# EAGLE design expansioncard-template (EAGLE 7.5.0)

## Sheet 1 of 2: Board IO header
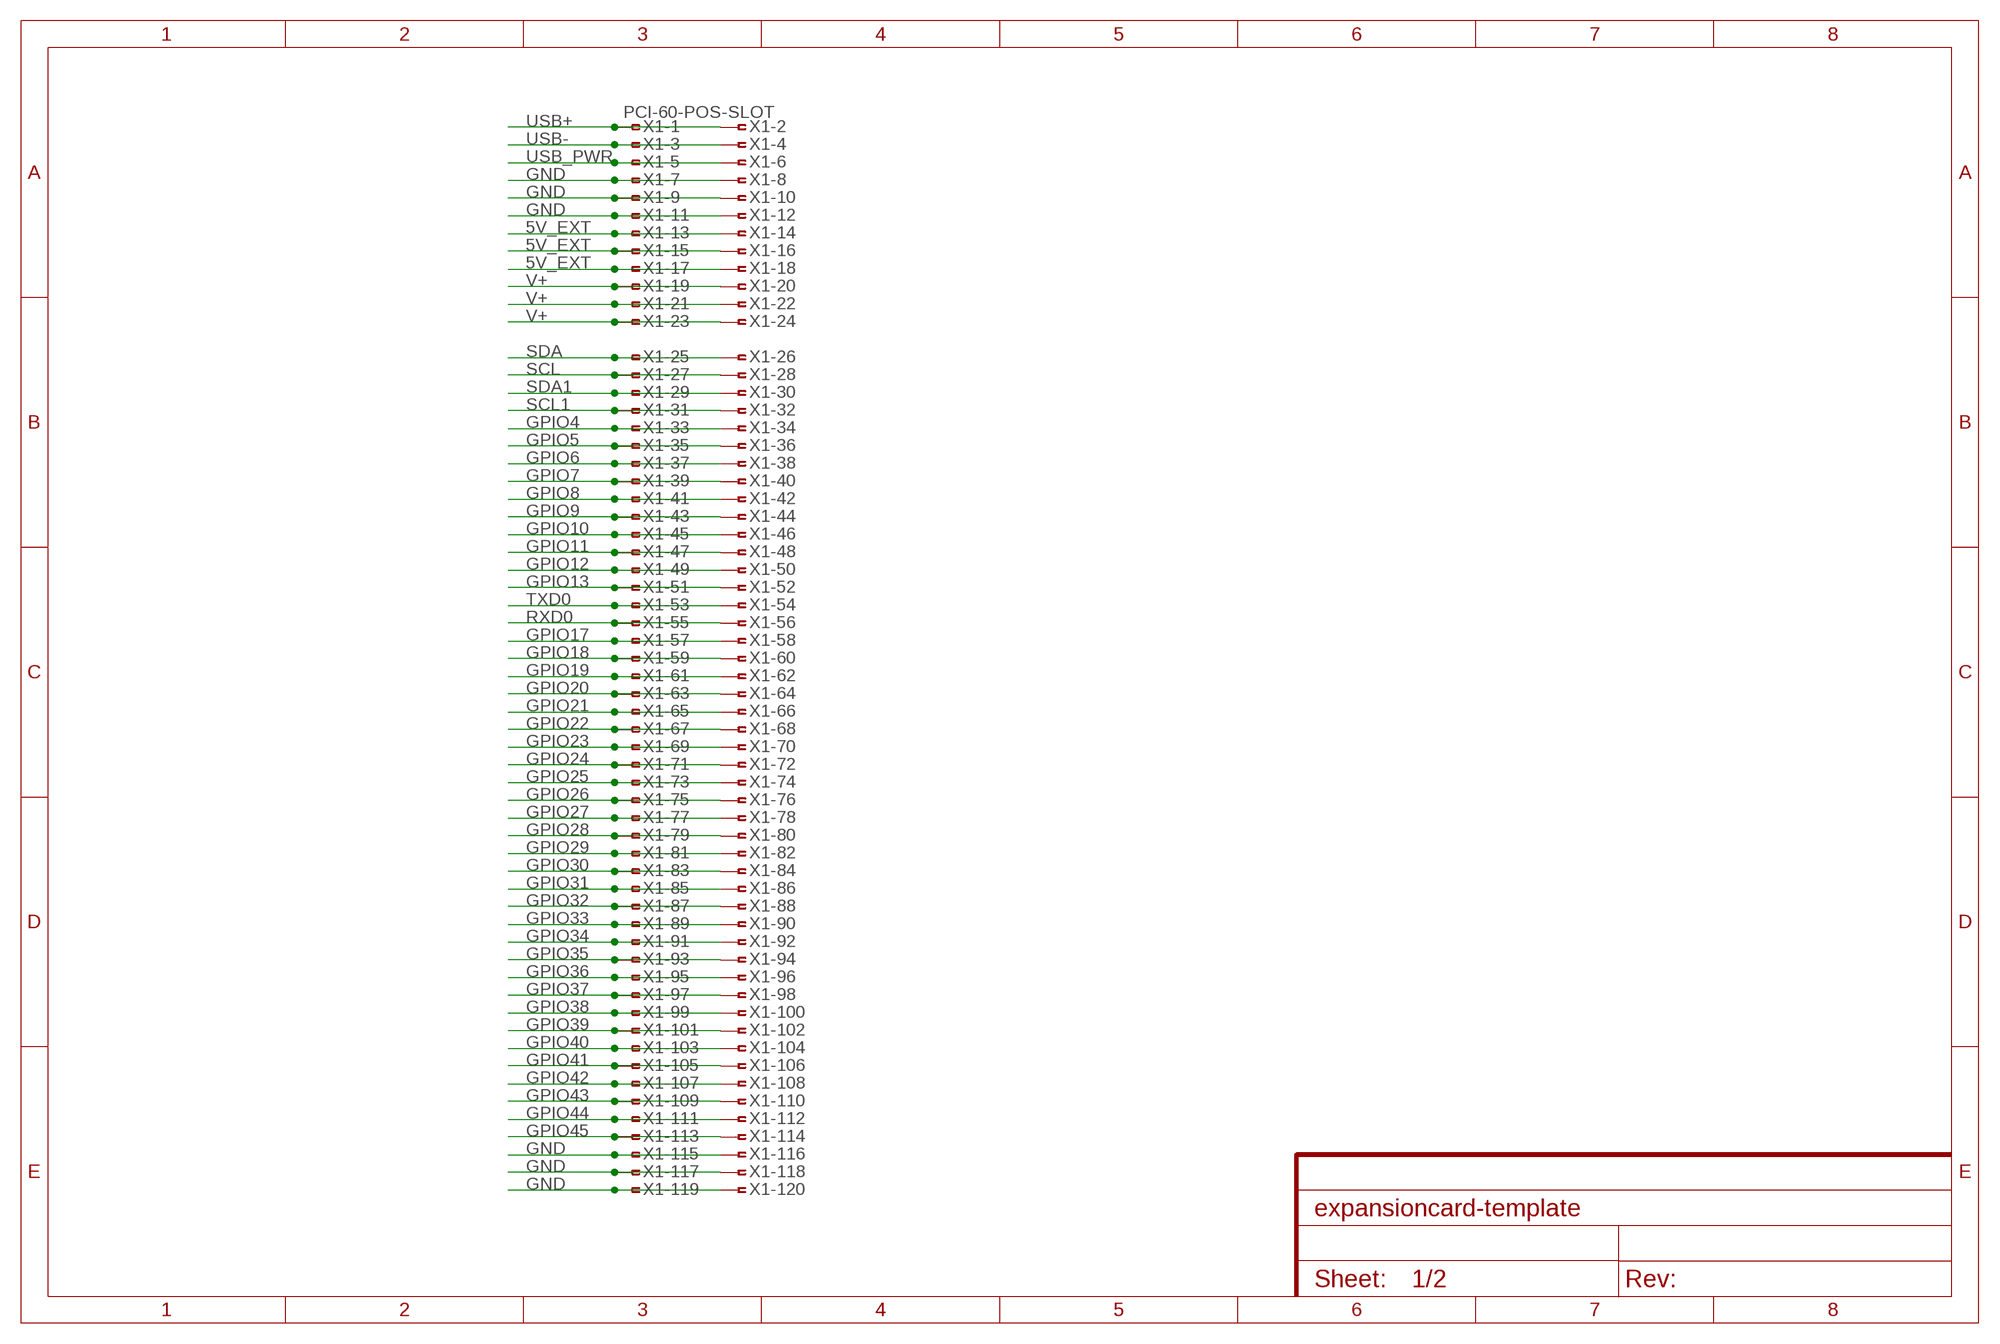
[diagram p0: schematic, sheet 1]

### Parts
X1  PCI-60-POS-SLOT  [PCI-SLOT-60]

### Nets
5V_EXT: X1.13 X1.14 X1.15 X1.16 X1.17 X1.18 ; also sheet 2
GND: X1.7 X1.8 X1.9 X1.10 X1.11 X1.12 X1.115 X1.116 X1.117 X1.118 X1.119 X1.120 ; also sheet 2
GPIO4: X1.33 X1.34
GPIO5: X1.35 X1.36
GPIO6: X1.37 X1.38
GPIO7: X1.39 X1.40
GPIO8: X1.41 X1.42
GPIO9: X1.43 X1.44
GPIO10: X1.45 X1.46
GPIO11: X1.47 X1.48
GPIO12: X1.49 X1.50
GPIO13: X1.51 X1.52
GPIO17: X1.57 X1.58
GPIO18: X1.59 X1.60
GPIO19: X1.61 X1.62
GPIO20: X1.63 X1.64
GPIO21: X1.65 X1.66
GPIO22: X1.67 X1.68
GPIO23: X1.69 X1.70
GPIO24: X1.71 X1.72
GPIO25: X1.73 X1.74
GPIO26: X1.75 X1.76
GPIO27: X1.77 X1.78
GPIO28: X1.79 X1.80
GPIO29: X1.81 X1.82
GPIO30: X1.83 X1.84
GPIO31: X1.85 X1.86
GPIO32: X1.87 X1.88
GPIO33: X1.89 X1.90
GPIO34: X1.91 X1.92
GPIO35: X1.93 X1.94
GPIO36: X1.95 X1.96
GPIO37: X1.97 X1.98
GPIO38: X1.99 X1.100
GPIO39: X1.101 X1.102
GPIO40: X1.103 X1.104
GPIO41: X1.105 X1.106
GPIO42: X1.107 X1.108
GPIO43: X1.109 X1.110
GPIO44: X1.111 X1.112
GPIO45: X1.113 X1.114
RXD0: X1.55 X1.56
SCL: X1.27 X1.28
SCL1: X1.31 X1.32
SDA: X1.25 X1.26
SDA1: X1.29 X1.30
TXD0: X1.53 X1.54
USB+: X1.1 X1.2
USB-: X1.3 X1.4
USB_PWR: X1.5 X1.6
V+: X1.19 X1.20 X1.21 X1.22 X1.23 X1.24 ; also sheet 2

## Sheet 2 of 2: Power Management
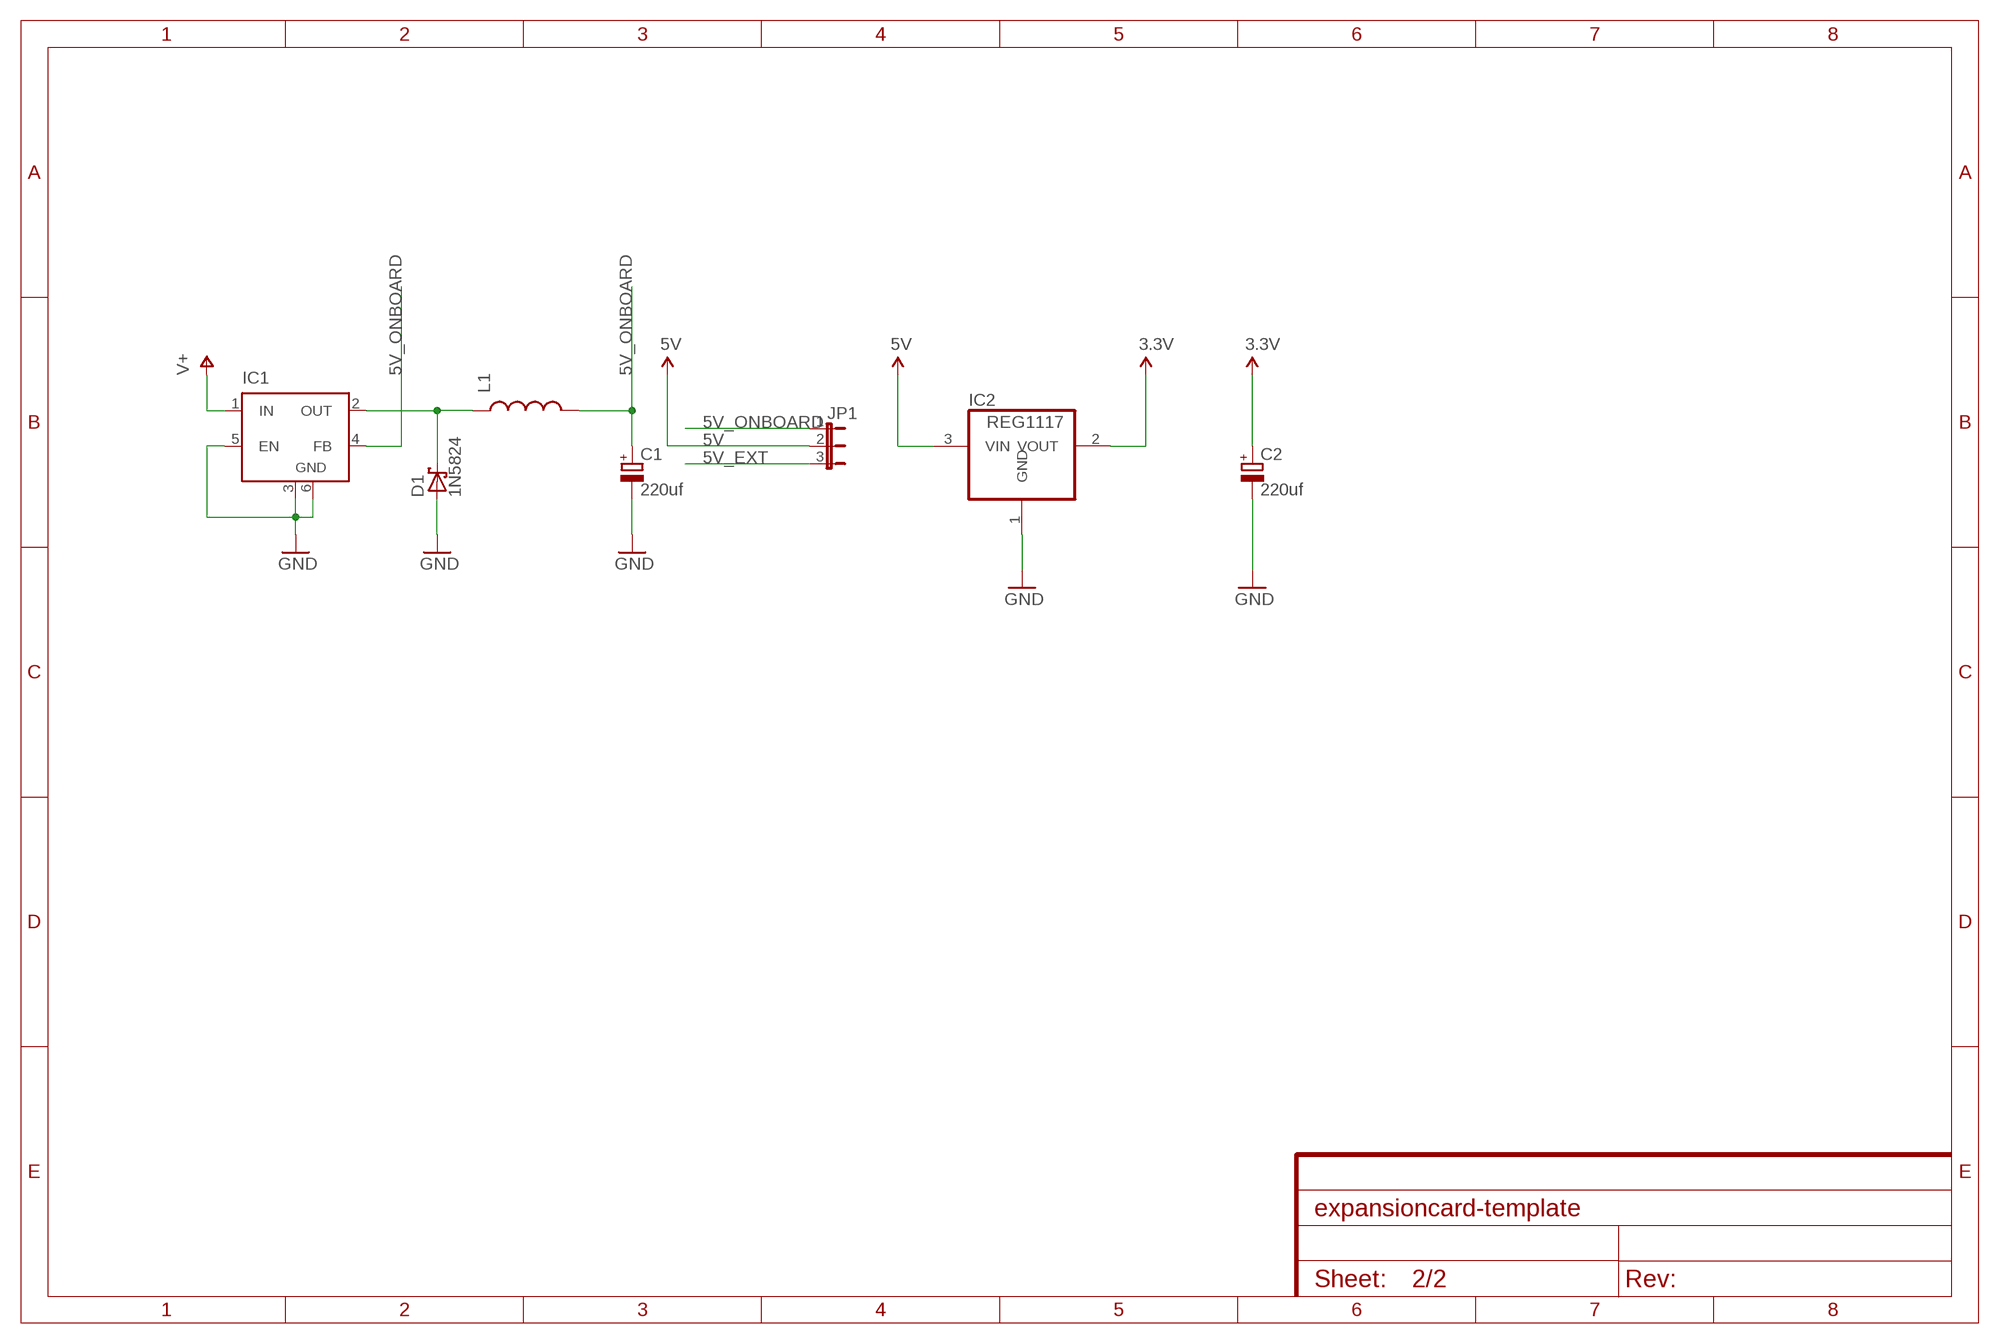
[diagram p1: schematic, sheet 2]

### Parts
C1  220uf  CPOL-EUE2.5-6  [E2,5-6]
C2  220uf  CPOL-EUE2.5-6  [E2,5-6]
D1  1N5824  1N5817-B  [DO41-7.6]
IC1  LM2596S  [TO263-5]
IC2  REG1117  [SOT223]
JP1  JP2E  [JP2]
L1  INDUCTORSRU1038  [SRU1038]

### Nets
3.3V: C2.+ IC2.2(VOUT)
5V: IC2.3(VIN) JP1.2
5V_EXT: JP1.3 ; also sheet 1
5V_ONBOARD: C1.+ IC1.4(FB) JP1.1 L1.2
GND: C1.- C2.- D1.A IC1.3(GND) IC1.5(EN) IC1.6(GND) IC2.1(GND) ; also sheet 1
V+: IC1.1(IN) ; also sheet 1
VOUT: D1.C IC1.2(OUT) L1.1

## Library data of the parts
C1 C2 = rcl:CPOL-EU: POLARIZED CAPACITOR, European symbol
D1 = diode:1N581*: 1.0A SCHOTTKY BARRIER RECTIFIER Source: http://www.diodes.com/datasheets/ds23001.pdf
IC1 = linear:LM2596S: STEP-DOWN VOLTAGE REGULATOR
IC2 = burr-brown:REG1117: 800mA and 1A Low Dropout (LDO) Positive Regulator 1.8V, 2.5V, 2.85V, 3.3V, 5V, and Adj; MPN: REG1117; OC_FARNELL: 1097566; OC_NEWARK: 14P6981
JP1 = jumper:JP2E: JUMPER
L1 = SparkFun-Passives:INDUCTOR: Inductors Basic Inductor/Choke - 0603 and 1206. Footprints are not proven and vary greatly between part numbers. SRN6045- 33uH, 20% 1.4A SDR0403-560KL - 56uH, 10%, 500mA RMS/740mA peak
X1 = con-amp:PCI-60-POS: PCI-SLOT 60 Dual Position 0.05 Series Standard Edge Source: http://catalog.tycoelectronics.com .. ENG_CD_145167_F.pdf

## Board
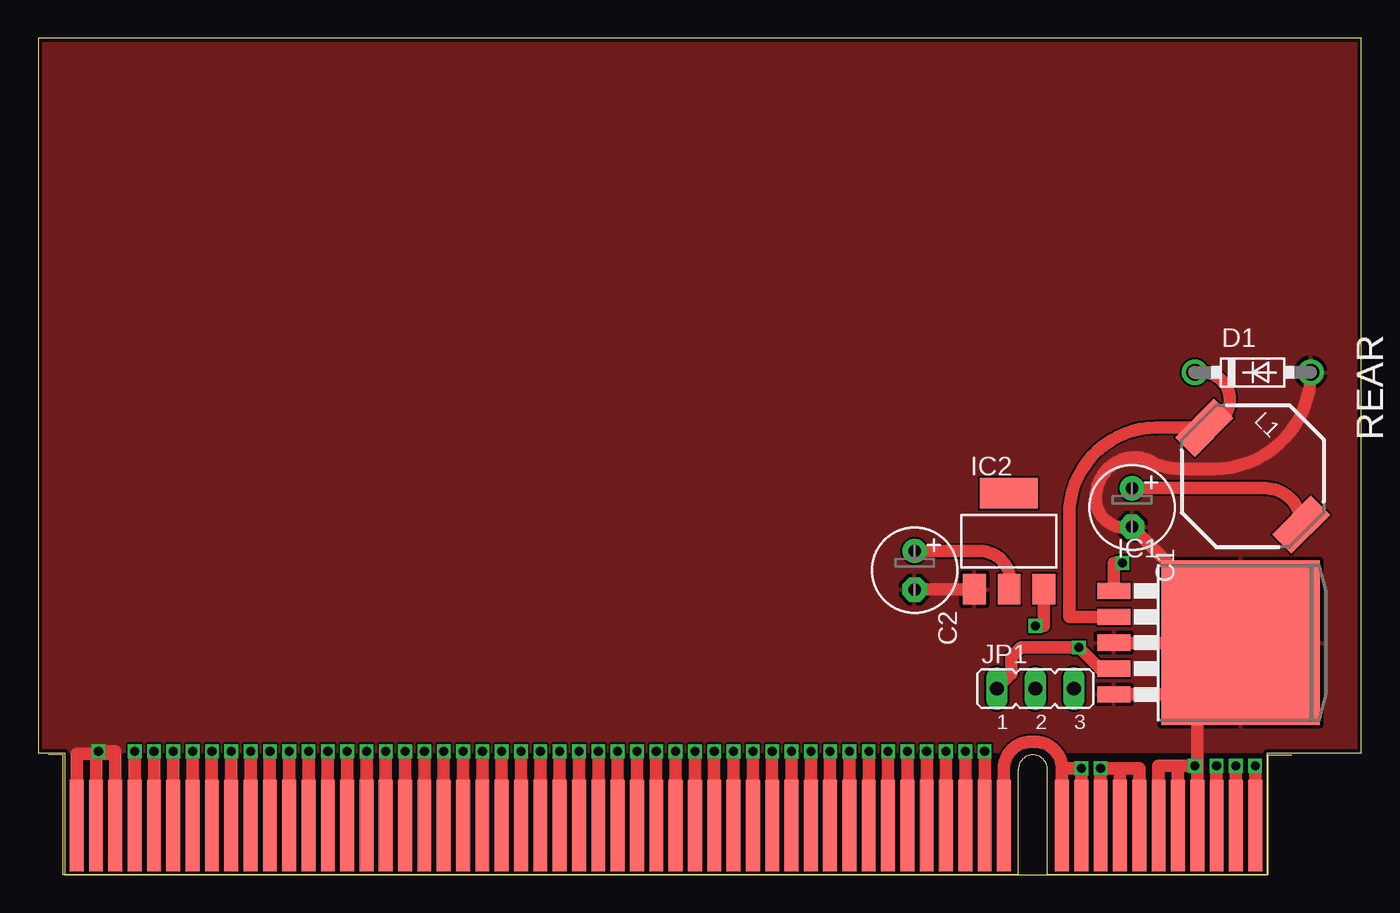
[diagram p2: board, top side]
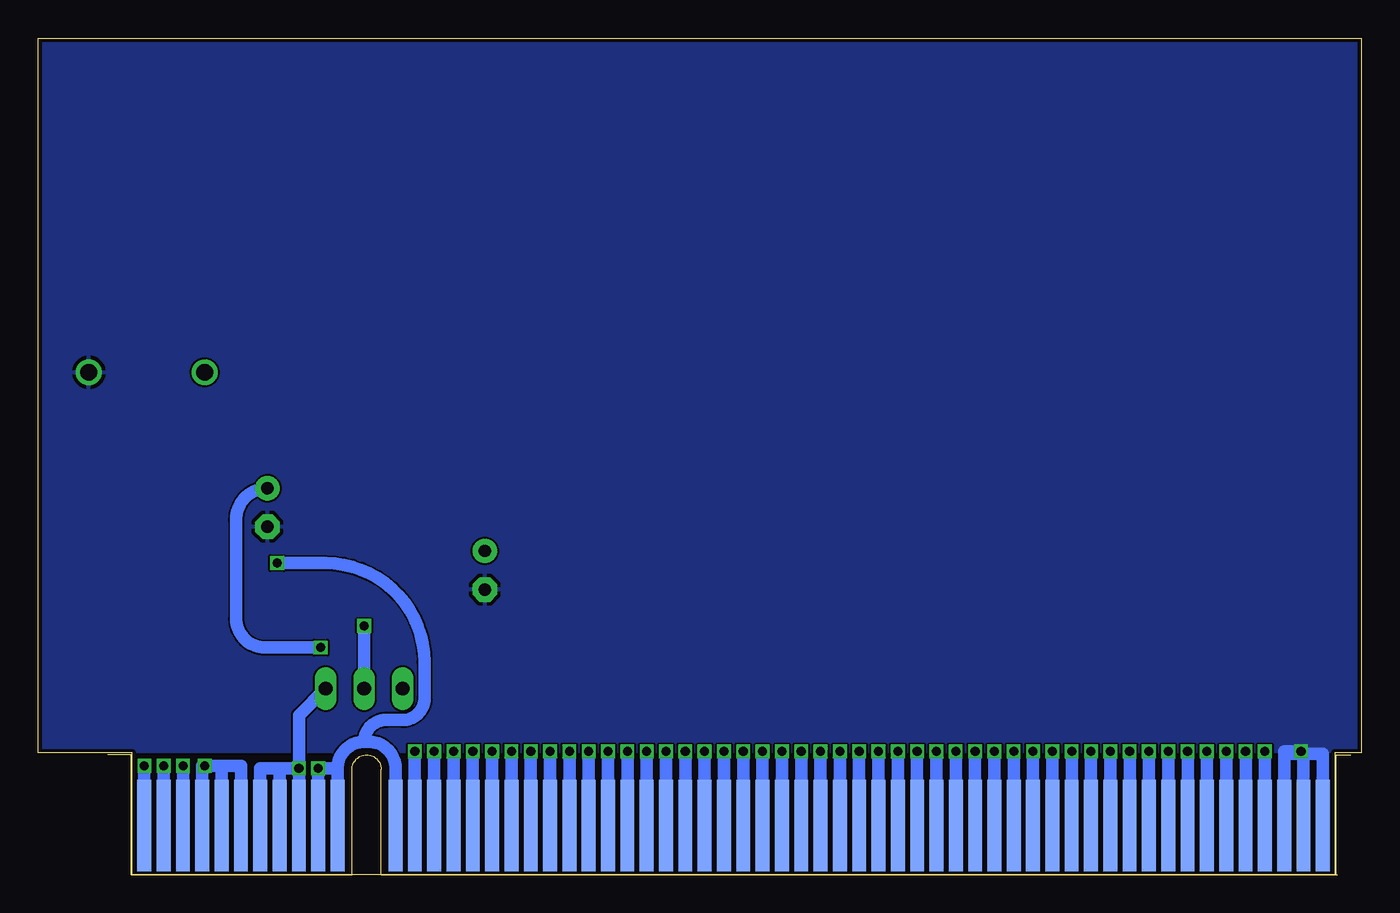
[diagram p3: board, bottom side, seen from below]

Size 87 x 55 mm. Coordinates in mm from the lower left corner, seen from the top.
Outline: 1.75,0 80.8,0 80.8,8 87,8 87,55 0,55 0,8 1.75,8 1.75,0
Copper layers (1*16): Top 0.035mm / dielectric 1.5mm / Bottom 0.035mm
Design rules "dirtypcbs": minimum track width 5mil, minimum drill 12mil, track to track 5mil, track to pad 5mil, pad to pad 5mil, via to via 5mil, smd to smd 0mil, copper to edge 10mil, drill to drill 10mil, minimum pad ring 10mil, minimum via ring 6mil, stop-mask expansion 2mil, vias tented up to drill 25mil, thermal gap 10mil

### Footprints (pad centres in the part's own frame; a part is rotated, then mirrored left to right if it is on the bottom)
E2,5-6 = drill 0.813 pad 1.6: + -1.27,0 | drill 0.813 pad 1.6 octagon: - 1.27,0
DO41-7.6 = drill 1.1 pad 1.7: A 3.81,0; C -3.81,0
TO263-5 = smd 1.067 x 2.159: 1 -3.404,-5.791; 2 -1.702,-5.791; 3 0,-5.791; 4 1.702,-5.791; 5 3.404,-5.791 | smd 10.8 x 10.41: 6 0,2.54
SOT223 = smd 1.499 x 2.007: 1 -2.261,-3.15; 2 0.025,-3.15; 3 2.311,-3.15 | smd 3.81 x 2.007: 4 0,3.15
JP2 = drill 0.914 long: 1 -2.54,0; 2 0,0; 3 2.54,0
SRU1038 = smd 1.8 x 3.6: 1 -4.5,0; 2 4.5,0
PCI-SLOT-60 = smd 0.91 x 6: 1 0,3.22; 3 1.27,3.22; 5 2.54,3.22; 7 3.81,3.22; 9 5.08,3.22; 11 6.35,3.22; 13 7.62,3.22; 15 8.89,3.22; 17 10.16,3.22; 19 11.43,3.22; 21 12.7,3.22; 23 16.51,3.22; 25 17.78,3.22; 27 19.05,3.22; 29 20.32,3.22; 31 21.59,3.22; 33 22.86,3.22; 35 24.13,3.22; 37 25.4,3.22; 39 26.67,3.22; 41 27.94,3.22; 43 29.21,3.22; 45 30.48,3.22; 47 31.75,3.22; 49 33.02,3.22; 51 34.29,3.22; 53 35.56,3.22; 55 36.83,3.22; 57 38.1,3.22; 59 39.37,3.22; 61 40.64,3.22; 63 41.91,3.22; 65 43.18,3.22; 67 44.45,3.22; 69 45.72,3.22; 71 46.99,3.22; 73 48.26,3.22; 75 49.53,3.22; 77 50.8,3.22; 79 52.07,3.22; 81 53.34,3.22; 83 54.61,3.22; 85 55.88,3.22; 87 57.15,3.22; 89 58.42,3.22; 91 59.69,3.22; 93 60.96,3.22; 95 62.23,3.22; 97 63.5,3.22; 99 64.77,3.22; 101 66.04,3.22; 103 67.31,3.22; 105 68.58,3.22; 107 69.85,3.22; 109 71.12,3.22; 111 72.39,3.22; 113 73.66,3.22; 115 74.93,3.22; 117 76.2,3.22; 119 77.47,3.22 | smd 0.91 x 6 bottom: 2 0,3.22; 4 1.27,3.22; 6 2.54,3.22; 8 3.81,3.22; 10 5.08,3.22; 12 6.35,3.22; 14 7.62,3.22; 16 8.89,3.22; 18 10.16,3.22; 20 11.43,3.22; 22 12.7,3.22; 24 16.51,3.22; 26 17.78,3.22; 28 19.05,3.22; 30 20.32,3.22; 32 21.59,3.22; 34 22.86,3.22; 36 24.13,3.22; 38 25.4,3.22; 40 26.67,3.22; 42 27.94,3.22; 44 29.21,3.22; 46 30.48,3.22; 48 31.75,3.22; 50 33.02,3.22; 52 34.29,3.22; 54 35.56,3.22; 56 36.83,3.22; 58 38.1,3.22; 60 39.37,3.22; 62 40.64,3.22; 64 41.91,3.22; 66 43.18,3.22; 68 44.45,3.22; 70 45.72,3.22; 72 46.99,3.22; 74 48.26,3.22; 76 49.53,3.22; 78 50.8,3.22; 80 52.07,3.22; 82 53.34,3.22; 84 54.61,3.22; 86 55.88,3.22; 88 57.15,3.22; 90 58.42,3.22; 92 59.69,3.22; 94 60.96,3.22; 96 62.23,3.22; 98 63.5,3.22; 100 64.77,3.22; 102 66.04,3.22; 104 67.31,3.22; 106 68.58,3.22; 108 69.85,3.22; 110 71.12,3.22; 112 72.39,3.22; 114 73.66,3.22; 116 74.93,3.22; 118 76.2,3.22; 120 77.47,3.22

### Placement (x,y rotation side)
C1  71.91,24.13 270 top
C2  57.63,20 270 top
D1  79.85,33.02 0 top
IC1  76.52,15.24 270 top
IC2  63.82,21.91 0 top
JP1  65.56,12.22 0 top
L1  79.85,26.19 315 top
X1  80.01,0 0 bottom

### Tracks (layer width: path | path; a pad name or v marks a point on that pad's centre or on a via)
3.3V
  Top 0.813: C2.+ 61.91,21.27 arc-105 IC2.2
5V  (via drill 0.6)
  Top 0.813: IC2.3 66.13,16.35 v65.56,16.35
  Bottom 0.813: v65.56,16.35 JP1.2
5V_EXT  (via drill 0.6)
  Top 0.813: X1.18 v69.85,6.99 71.12,6.99 | 71.12,6.99 72.39,6.99 X1.14 | X1.16 71.12,6.99
  Bottom 0.813: v69.85,6.99 X1.18 | X1.16 71.12,6.99 | 71.12,6.99 v69.85,6.99 | X1.14 72.39,6.99 71.12,6.99 | v69.85,6.99 69.85,10.48 JP1.3
5V_ONBOARD  (via drill 0.6)
  Top 0.813: IC1.4 69.81,13.54 v68.42,14.92 64.61,14.92 63.98,14.29 63.98,13.18 JP1.1 | L1.2 arc90 80.64,25.4 C1.+
  Bottom 0.813: C1.+ arc-90 73.98,23.34 73.98,16.83 arc-90 72.07,14.92 v68.42,14.92
GND  (via drill 0.6)
  Top 0.813: X1.12 73.66,7.14 74.93,7.14 | 74.93,7.14 v76.04,7.14 | v76.04,7.14 76.2,7.14 | X1.8 76.2,7.14 | X1.10 74.93,7.14 | 76.2,7.14 76.2,7.3 | 76.2,7.3 76.2,11.84 | 76.2,15.24 IC1.6 79.06,15.72 C1.- arc-105 69.53,24.77 arc-47 70.48,26.83 arc-70 73.18,27.15 arc28 75.09,26.67 77.31,26.67 arc90 D1.A | IC1.5 76.2,11.84 | 76.2,11.84 76.2,15.24 | IC1.3 76.2,15.24 | v76.04,7.14 76.04,7.3 76.2,7.3 | C2.- 58.74,18.73 arc1 IC2.1 | 3.81,7.94 2.54,7.94 X1.120 | 3.81,7.94 X1.118 | 3.81,7.94 3.81,8.1 v3.97,8.1 5.08,8.1 X1.116 5.08,7.94 3.81,7.94
  Bottom 0.813: X1.12 73.66,7.14 v76.04,7.14 | X1.8 76.2,7.14 v76.04,7.14 | X1.10 74.93,7.14 v76.04,7.14 | X1.120 2.54,7.94 3.81,7.94 | 3.81,7.94 X1.118 | 3.81,7.94 5.08,7.94 X1.116 5.08,8.1 v3.97,8.1
  pour Top: 0,55 87,55 87,8 0,8
  pour Bottom: 0,55 87,55 87,8 0,8
GPIO4  (via drill 0.6)
  Top 0.813: v57.15,8.1 X1.34
  Bottom 0.813: X1.34 v57.15,8.1
GPIO5  (via drill 0.6)
  Top 0.813: X1.36 v55.88,8.1
  Bottom 0.813: v55.88,8.1 X1.36
GPIO6  (via drill 0.6)
  Top 0.813: v54.61,8.1 X1.38
  Bottom 0.813: X1.38 v54.61,8.1
GPIO7  (via drill 0.6)
  Top 0.813: X1.40 v53.34,8.1
  Bottom 0.813: v53.34,8.1 X1.40
GPIO8  (via drill 0.6)
  Top 0.813: v52.07,8.1 X1.42
  Bottom 0.813: X1.42 v52.07,8.1
GPIO9  (via drill 0.6)
  Top 0.813: X1.44 v50.8,8.1
  Bottom 0.813: v50.8,8.1 X1.44
GPIO10  (via drill 0.6)
  Top 0.813: v49.53,8.1 X1.46 49.53,2.86
  Bottom 0.813: X1.46 v49.53,8.1
GPIO11  (via drill 0.6)
  Top 0.813: X1.48 v48.26,8.1
  Bottom 0.813: v48.26,8.1 X1.48
GPIO12  (via drill 0.6)
  Top 0.813: X1.50 v46.99,8.1
  Bottom 0.813: v46.99,8.1 X1.50
GPIO13  (via drill 0.6)
  Top 0.813: v45.72,8.1 X1.52
  Bottom 0.813: X1.52 v45.72,8.1
GPIO17  (via drill 0.6)
  Top 0.813: X1.58 v41.91,8.1
  Bottom 0.813: v41.91,8.1 X1.58
GPIO18  (via drill 0.6)
  Top 0.813: v40.64,8.1 X1.60
  Bottom 0.813: X1.60 v40.64,8.1
GPIO19  (via drill 0.6)
  Top 0.813: X1.62 v39.37,8.1
  Bottom 0.813: v39.37,8.1 X1.62
GPIO20  (via drill 0.6)
  Top 0.813: X1.64 v38.1,8.1
  Bottom 0.813: v38.1,8.1 X1.64
GPIO21  (via drill 0.6)
  Top 0.813: v36.83,8.1 X1.66
  Bottom 0.813: X1.66 v36.83,8.1
GPIO22  (via drill 0.6)
  Top 0.813: v35.56,8.1 X1.68
  Bottom 0.813: X1.68 v35.56,8.1
GPIO23  (via drill 0.6)
  Top 0.813: v34.29,8.1 X1.70
  Bottom 0.813: X1.70 v34.29,8.1
GPIO24  (via drill 0.6)
  Top 0.813: X1.72 v33.02,8.1
  Bottom 0.813: v33.02,8.1 X1.72
GPIO25  (via drill 0.6)
  Top 0.813: v31.75,8.1 X1.74
  Bottom 0.813: X1.74 v31.75,8.1
GPIO26  (via drill 0.6)
  Top 0.813: X1.76 v30.48,8.1
  Bottom 0.813: v30.48,8.1 X1.76
GPIO27  (via drill 0.6)
  Top 0.813: v29.21,8.1 X1.78
  Bottom 0.813: X1.78 v29.21,8.1
GPIO28  (via drill 0.6)
  Top 0.813: X1.80 v27.94,8.1
  Bottom 0.813: v27.94,8.1 X1.80
GPIO29  (via drill 0.6)
  Top 0.813: v26.67,8.1 X1.82
  Bottom 0.813: X1.82 v26.67,8.1
GPIO30  (via drill 0.6)
  Top 0.813: X1.84 v25.4,8.1
  Bottom 0.813: v25.4,8.1 X1.84
GPIO31  (via drill 0.6)
  Top 0.813: v24.13,8.1 X1.86
  Bottom 0.813: X1.86 v24.13,8.1
GPIO32  (via drill 0.6)
  Top 0.813: X1.88 v22.86,8.1
  Bottom 0.813: v22.86,8.1 X1.88
GPIO33  (via drill 0.6)
  Top 0.813: v21.59,8.1 X1.90
  Bottom 0.813: X1.90 v21.59,8.1
GPIO34  (via drill 0.6)
  Top 0.813: X1.92 v20.32,8.1
  Bottom 0.813: v20.32,8.1 X1.92
GPIO35  (via drill 0.6)
  Top 0.813: v19.05,8.1 X1.94
  Bottom 0.813: X1.94 v19.05,8.1
GPIO36  (via drill 0.6)
  Top 0.813: X1.96 v17.78,8.1
  Bottom 0.813: v17.78,8.1 X1.96
GPIO37  (via drill 0.6)
  Top 0.813: v16.51,8.1 X1.98
  Bottom 0.813: X1.98 v16.51,8.1
GPIO38  (via drill 0.6)
  Top 0.813: X1.100 v15.24,8.1
  Bottom 0.813: v15.24,8.1 X1.100
GPIO39  (via drill 0.6)
  Top 0.813: v13.97,8.1 X1.102
  Bottom 0.813: X1.102 v13.97,8.1
GPIO40  (via drill 0.6)
  Top 0.813: X1.104 v12.7,8.1
  Bottom 0.813: v12.7,8.1 X1.104
GPIO41  (via drill 0.6)
  Top 0.813: v11.43,8.1 X1.106
  Bottom 0.813: X1.106 v11.43,8.1
GPIO42  (via drill 0.6)
  Top 0.813: X1.108 v10.16,8.1
  Bottom 0.813: v10.16,8.1 X1.108
GPIO43  (via drill 0.6)
  Top 0.813: v8.89,8.1 X1.110
  Bottom 0.813: X1.110 v8.89,8.1
GPIO44  (via drill 0.6)
  Top 0.813: X1.112 v7.62,8.1
  Bottom 0.813: v7.62,8.1 X1.112
GPIO45  (via drill 0.6)
  Top 0.813: v6.35,8.1 X1.114
  Bottom 0.813: X1.114 v6.35,8.1
RXD0  (via drill 0.6)
  Top 0.813: v43.18,8.1 X1.56
  Bottom 0.813: X1.56 v43.18,8.1
SCL  (via drill 0.6)
  Top 0.813: v60.96,8.1 X1.28
  Bottom 0.813: X1.28 v60.96,8.1
SCL1  (via drill 0.6)
  Top 0.813: X1.32 v58.42,8.1
  Bottom 0.813: v58.42,8.1 X1.32
SDA  (via drill 0.6)
  Top 0.813: X1.26 v62.23,8.1
  Bottom 0.813: v62.23,8.1 X1.26
SDA1  (via drill 0.6)
  Top 0.813: v59.69,8.1 X1.30
  Bottom 0.813: X1.30 v59.69,8.1
TXD0  (via drill 0.6)
  Top 0.813: X1.54 v44.45,8.1
  Bottom 0.813: v44.45,8.1 X1.54
USB+  (via drill 0.6)
  Top 0.813: v80.01,7.14 X1.2
  Bottom 0.813: X1.2 v80.01,7.14
USB-  (via drill 0.6)
  Top 0.813: X1.4 v78.74,7.14
  Bottom 0.813: v78.74,7.14 X1.4
USB_PWR  (via drill 0.6)
  Top 0.813: v77.47,7.14 X1.6
  Bottom 0.813: X1.6 v77.47,7.14
V+  (via drill 0.6)
  Top 0.813: X1.20 v68.58,6.99 67.31,6.99 | 67.31,6.99 X1.22 | X1.24 63.5,6.99 arc-90 65.25,8.73 65.56,8.73 arc-90 67.31,6.99 | IC1.1 70.73,20.48 v71.28,20.48
  Bottom 0.813: X1.22 67.31,6.99 | 67.31,6.99 v68.58,6.99 X1.20 | X1.24 63.5,6.99 arc-90 65.25,8.73 65.56,8.73 | 65.56,8.73 arc-90 67.31,6.99 | v71.28,20.48 68.1,20.48 arc90 61.59,13.97 61.59,11.59 arc90 63.02,10.16 64.14,10.16 arc-90 65.56,8.73
VOUT
  Top 0.813: IC1.2 67.79,16.94 67.79,23.65 arc-90 73.51,29.38 L1.1 arc175 76.52,33.02 D1.C

### Text on the board
tPlace: REAR